# Altium project PCB_Attiny_composant.PrjPcb
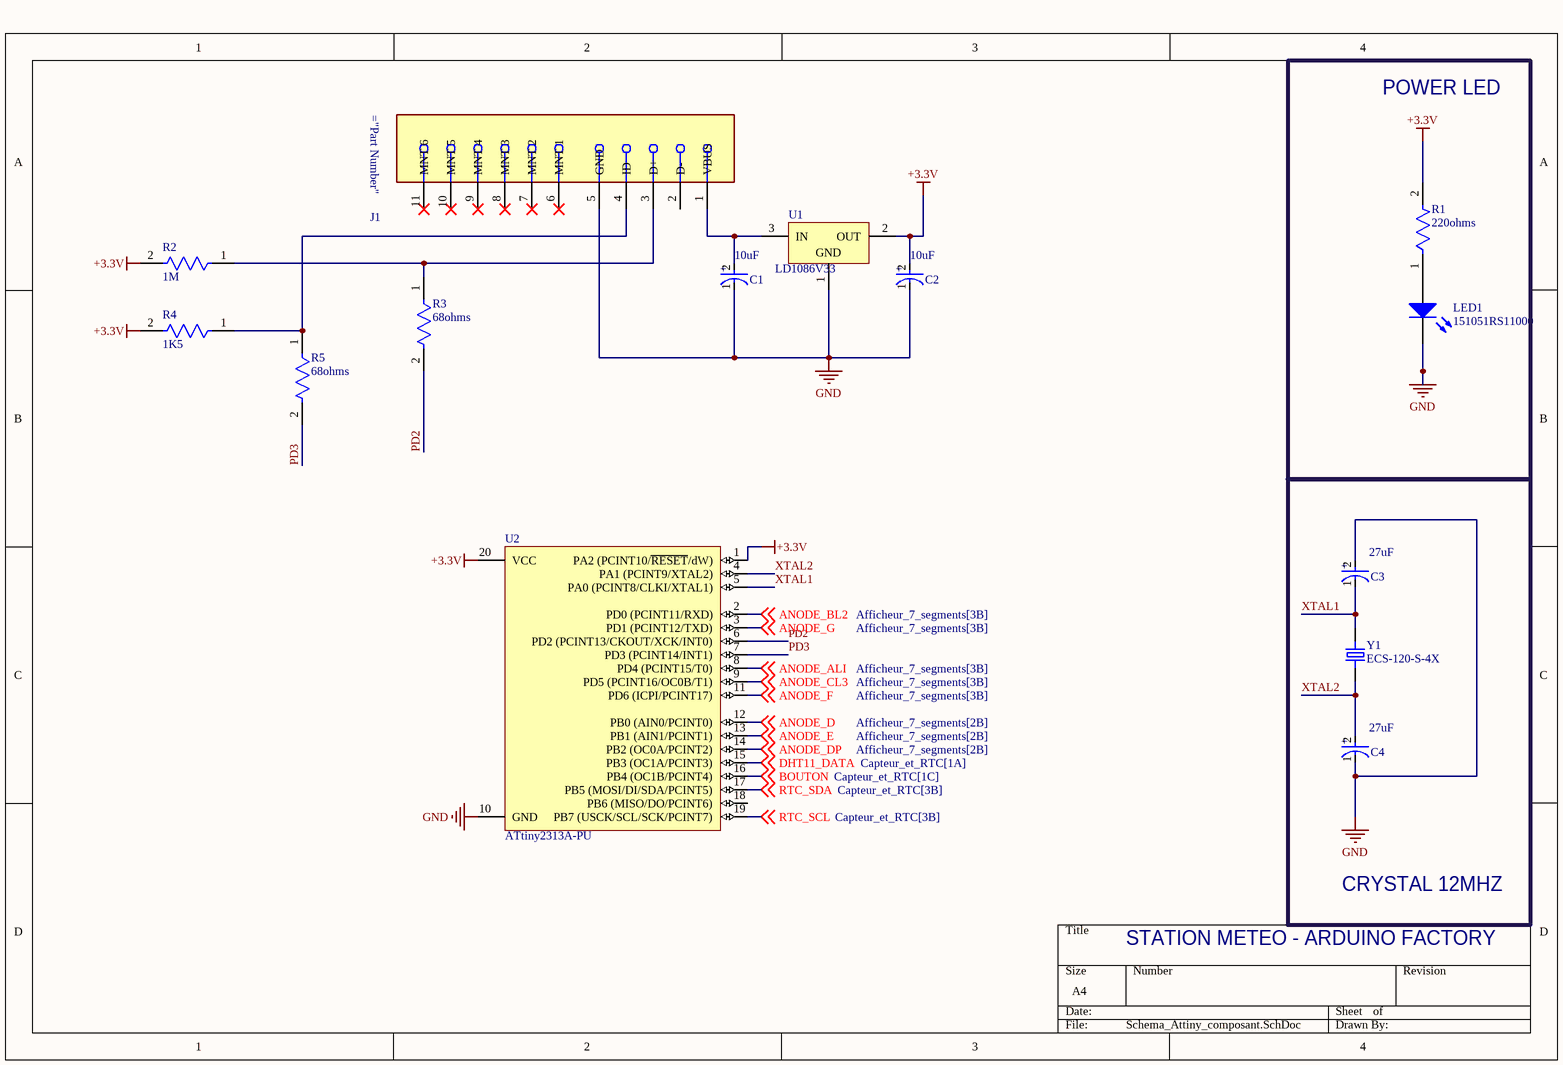
[diagram p0: Schema_Attiny_composant.SchDoc]
3 sheets, 20 parts. Net scope: global (net labels, ports and power ports of the same name join across sheets).
Board file: PCB_Attiny_composant.PcbDoc
Sheets:
  Schema_Attiny_composant.SchDoc
  Afficheur_7_segments.SchDoc
  Capteur_et_RTC.SchDoc

## Sheet Schema_Attiny_composant.SchDoc
size A4; SheetNumber: 1; SheetTotal: 3

### Parts
C1  10uF  [Rubycon_0_MFG]
C2  10uF  [Rubycon_0_MFG]
C3  27uF  [Rubycon_0_MFG]
C4  27uF  [Rubycon_0_MFG]
J1  105164-0001  [Molex_105164-0001_0]  (value not drawn)
LED1  151051RS11000  [Type 5mm]
R1  220ohms  [Stackpole_Electronics_Inc._CF14JT1K00_0]
R2  1M  [Stackpole_Electronics_Inc._CF14JT1K00_0]
R3  68ohms  [Stackpole_Electronics_Inc._CF14JT1K00_0]
R4  1K5  [Stackpole_Electronics_Inc._CF14JT1K00_0]
R5  68ohms  [Stackpole_Electronics_Inc._CF14JT1K00_0]
U1  LD1086V33  [TO220]
U2  ATtiny2313A-PU  [20P3]
Y1  ECS-120-S-4X  [XTAL_ECS-120-S-4X]

### Blocks framed on the sheet
POWER LED: LED1 R1
CRYSTAL 12MHZ: C3 C4 Y1

### Nets
+3.3V: C2.2(A) R1.2 R2.2 R4.2 U1.2(OUT) U2.1(PA2_(PCINT10/~{RESET}/dW)) U2.20(VCC)
GND: C1.1(C) C2.1(C) C3.2(A) C4.1(C) J1.5(GND) LED1.1(K) U1.1(GND) U2.10(GND)
ANODE_ALI: U2.8(PD4_(PCINT15/T0)) ; off-sheet ANODE_ALI
ANODE_BL2: U2.2(PD0_(PCINT11/RXD)) ; off-sheet ANODE_BL2
ANODE_CL3: U2.9(PD5_(PCINT16/OC0B/T1)) ; off-sheet ANODE_CL3
ANODE_D: U2.12(PB0_(AIN0/PCINT0)) ; off-sheet ANODE_D
ANODE_DP: U2.14(PB2_(OC0A/PCINT2)) ; off-sheet ANODE_DP
ANODE_E: U2.13(PB1_(AIN1/PCINT1)) ; off-sheet ANODE_E
ANODE_F: U2.11(PD6_(ICPI/PCINT17)) ; off-sheet ANODE_F
ANODE_G: U2.3(PD1_(PCINT12/TXD)) ; off-sheet ANODE_G
BOUTON: U2.16(PB4_(OC1B/PCINT4)) ; off-sheet BOUTON
DHT11_DATA: U2.15(PB3_(OC1A/PCINT3)) ; off-sheet DHT11_DATA
PD2: R3.2 U2.6(PD2_(PCINT13/CKOUT/XCK/INT0))
PD3: R5.2 U2.7(PD3_(PCINT14/INT1))
RTC_SCL: U2.19(PB7_(USCK/SCL/SCK/PCINT7)) ; off-sheet RTC_SCL
RTC_SDA: U2.17(PB5_(MOSI/DI/SDA/PCINT5)) ; off-sheet RTC_SDA
XTAL1: C3.1(C) U2.5(PA0_(PCINT8/CLKI/XTAL1)) Y1.2
XTAL2: C4.2(A) U2.4(PA1_(PCINT9/XTAL2)) Y1.1
NetC1_2: C1.2(A) J1.1(VBUS) U1.3(IN)
NetJ1_3: J1.3(D+) R2.1 R3.1
NetJ1_4: J1.4(ID) R4.1 R5.1
NetLED1_2: LED1.2(A) R1.1

Not connected (* = marked no-connect by the designer): J1 2(D-) 6(MNT_1)* 7(MNT_2)* 8(MNT_3)* 9(MNT_4)* 10(MNT_5)* 11(MNT_6)*; U2 18(PB6_(MISO/DO/PCINT6))

### Notes on the sheet
- STATION METEO - ARDUINO FACTORY
- (in symbol 35ZLH100MEFC6_3X11) +

### Library data of the parts
C1-C4 = 35ZLH100MEFC6_3X11
LED1 = 151051RS11000: THT LED round mono-color color lens, WL-TMRW, Red; Manufacturer: Wuerth Elektronik; ComponentLink1Description: Manufacturer URL; ComponentLink2Description: Datasheet; ComponentLink1URL: http://www.we-online.com; ComponentLink2URL: http://katalog.we-online.de/pbs/datasheet/7448042001.pdfhttp://katalog.we-online.de/pbs/datasheet/7448042001.pdfhttp://katalog.we-online.de/pbs/datasheet/7448042001.pdfhttp://katalog.we-online.de/pbs/datasheet/151051RS11000.pdf; Emitting color: Red; PartNumber: 151051RS11000; PackageReference: Type 5mm
R1-R5 = MF0207FTE52-10K
U1 = LD1086V33: 1.5A, Low Drop Positive Voltage Regulator, 3.3V, 3-Pin TO-220; ComponentLink1Description: Manufacturer URL; ComponentLink2Description: Datasheet; ComponentLink3Description: Package Specification; ComponentLink3URL: http://www.st.com/internet/com/TECHNICAL_RESOURCES/TECHNICAL_LITERATURE/PACKAGE_INFORMATION/CD00004649.pdf; DatasheetVersion: 11/07/2011; ComponentLink1URL: http://www.st.com; PackageVersion: ver3.0; PackageDescription: TO, Thru-Hole, Vertical, Heatsink Mounted; 3 In-Line Leads; Pitch 2.54 mm; ComponentLink2URL: http://www.st.com/internet/com/TECHNICAL_RESOURCES/TECHNICAL_LITERATURE/DATASHEET/CD00001884.pdf; PackageReference: TO220; PartNumber: LD1086V33
U2 = ATTINY2313A-PU: 8-bit AVR Microcontroller, 1.8-5.5V, 2KB Flash, 128 Bytes EEPROM, 128 Bytes SRAM, 20-pin PDIP, Industrial Grade (-40°C to 85°C), Pb-Free; Code_JEDEC: MS-001-AD; PackageVersion: revC, Jan-2004; DatasheetVersion: revA, Dec-2009; PackageDescription: 20-lead (0.300"/7.62mm Wide) Plastic Dual Inline Package (PDIP); PackageReference: 20P3; PartNumber: ATTINY2313A-PU
Y1 = ECS-120-S-4X: CRYSTAL T/H; Package: None; Price: None; Value: *; MP: ECS-120-S-4X; Availability: Unavailable

## Sheet Afficheur_7_segments.SchDoc
size A4; SheetNumber: 2; SheetTotal: 3
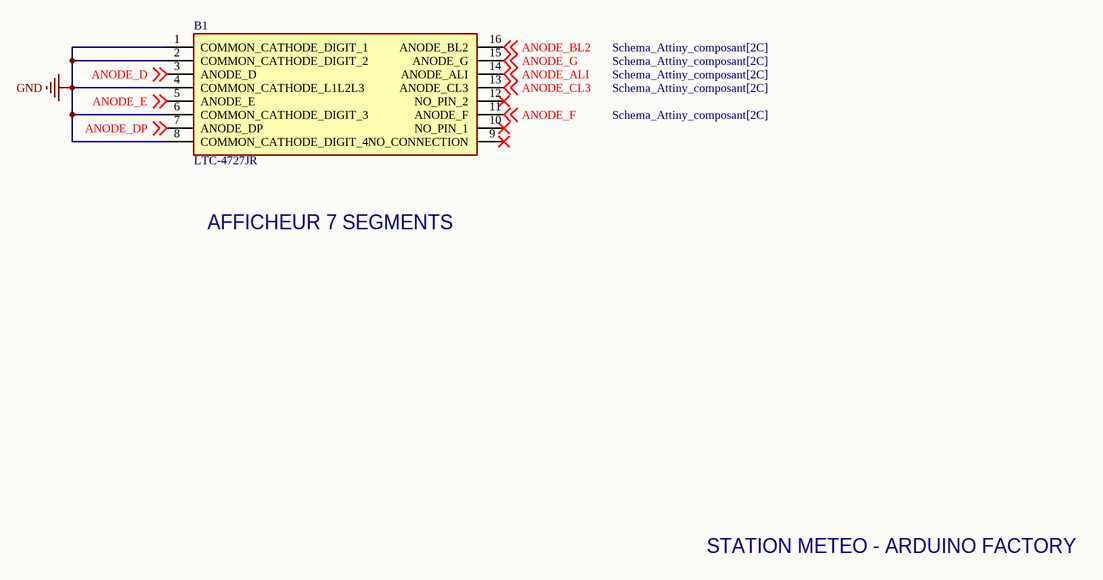
[diagram p1: Afficheur_7_segments.SchDoc]

### Parts
B1  LTC-4727JR  [DIP1016W75P254L4018H725Q16N]

### Nets
GND: B1.1(COMMON_CATHODE_DIGIT_1) B1.2(COMMON_CATHODE_DIGIT_2) B1.4(COMMON_CATHODE_L1L2L3) B1.6(COMMON_CATHODE_DIGIT_3) B1.8(COMMON_CATHODE_DIGIT_4)
ANODE_ALI: B1.14(ANODE_ALI) ; off-sheet ANODE_ALI
ANODE_BL2: B1.16(ANODE_BL2) ; off-sheet ANODE_BL2
ANODE_CL3: B1.13(ANODE_CL3) ; off-sheet ANODE_CL3
ANODE_D: B1.3(ANODE_D) ; off-sheet ANODE_D
ANODE_DP: B1.7(ANODE_DP) ; off-sheet ANODE_DP
ANODE_E: B1.5(ANODE_E) ; off-sheet ANODE_E
ANODE_F: B1.11(ANODE_F) ; off-sheet ANODE_F
ANODE_G: B1.15(ANODE_G) ; off-sheet ANODE_G

Not connected (* = marked no-connect by the designer): B1 9(NO_CONNECTION)* 10(NO_PIN_1)* 12(NO_PIN_2)*

### Notes on the sheet
- AFFICHEUR 7 SEGMENTS
- STATION METEO - ARDUINO FACTORY

### Library data of the parts
B1 = LTC-4727JR: Displays Panel 4DIGIT 35LED Sup. Red CC 14-Pin DIP Module; Manufacturer_Name: Lite-On; Geometry.Height: 7.25mm; Manufacturer_Part_Number: LTC-4727JR; Mouser Part Number: 859-LTC-4727JR; Mouser Price/Stock: https://www.mouser.co.uk/ProductDetail/Lite-On/LTC-4727JR?qs=WxFF5lh7QM1aHvF1YvDORQ%3D%3D; Arrow Part Number: LTC-4727JR; Arrow Price/Stock: https://www.arrow.com/en/products/ltc-4727jr/lite-on-technology?region=nac; Datasheet Link: https://componentsearchengine.com/Datasheets/1/LTC-4727JR.pdf

## Sheet Capteur_et_RTC.SchDoc
size A4; SheetNumber: 3; SheetTotal: 3
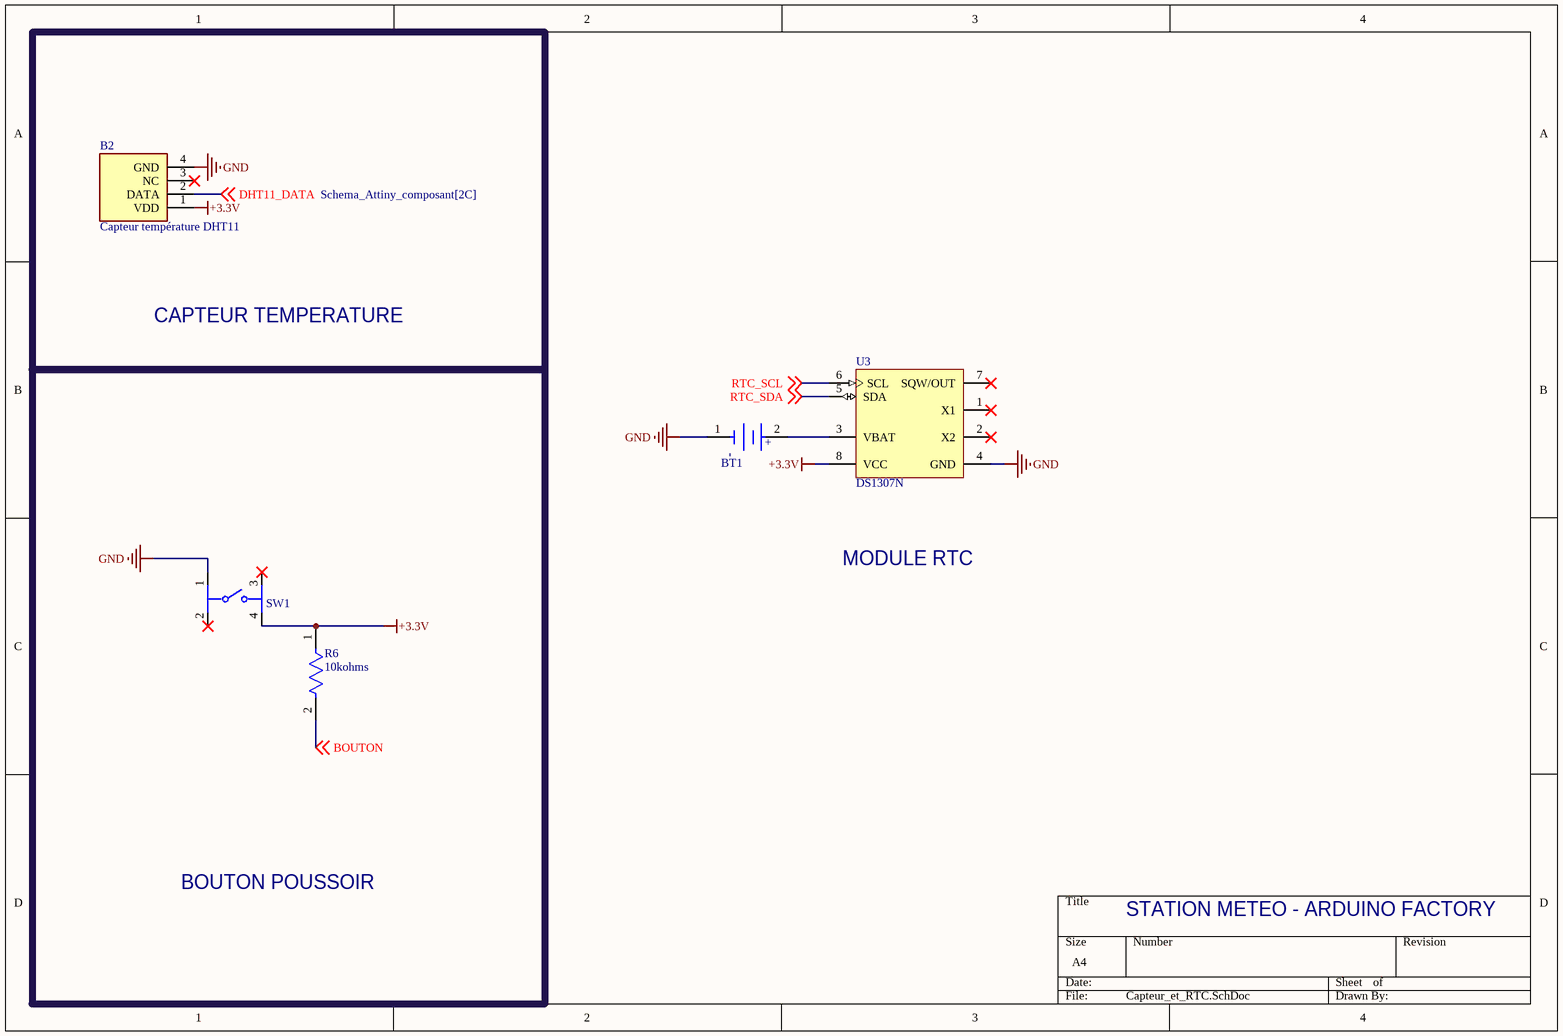
[diagram p2: Capteur_et_RTC.SchDoc]

### Parts
B2  Capteur température DHT11  [386]
BT1  3034TR  [Keystone_0_MFG]  (value not drawn)
R6  10kohms  [Stackpole_Electronics_Inc._CF14JT1K00_0]
SW1  1825910-2  [TE_0_0]  (value not drawn)
U3  DS1307N  [P8-2]

### Blocks framed on the sheet
CAPTEUR TEMPERATURE: B2
BOUTON POUSSOIR: R6 SW1

### Nets
+3.3V: B2.1(VDD) R6.1 SW1.4 U3.8(VCC)
GND: B2.4(GND) BT1.1(C) SW1.1 U3.4(GND)
BOUTON: R6.2 ; off-sheet BOUTON
DHT11_DATA: B2.2(DATA) ; off-sheet DHT11_DATA
RTC_SCL: U3.6(SCL) ; off-sheet RTC_SCL
RTC_SDA: U3.5(SDA) ; off-sheet RTC_SDA
NetBT1_2: BT1.2(A) U3.3(VBAT)

Not connected (* = marked no-connect by the designer): B2 3(NC)*; SW1 2* 3*; U3 1(X1)* 2(X2)* 7(SQW/OUT)*

### Notes on the sheet
- MODULE RTC
- STATION METEO - ARDUINO FACTORY
- (in symbol 3034TR) +; -

### Library data of the parts
B2 = 386: Adafruit Accessories DHT11 Basic Temp Humidity Sensor; Geometry.Height: 15.5mm; Manufacturer_Name: Adafruit; Manufacturer_Part_Number: 386; Mouser Part Number: 485-386; Mouser Price/Stock: https://www.mouser.co.uk/ProductDetail/Adafruit/386?qs=GURawfaeGuDbeGFpZ2393w%3D%3D; Arrow Part Number: 386; Arrow Price/Stock: https://www.arrow.com/en/products/386/adafruit-industries?region=nac; Datasheet Link: https://datasheet.datasheetarchive.com/originals/distributors/DKDS-1/1982.pdf
R6 = MF0207FTE52-10K
U3 = DS1307N: 64 x 8, Serial, I2C Real-Time Clock, 5.0V, 8-Pin PDIP, -40 to 85 degC; ComponentLink1Description: Manufacturer URL; ComponentLink2Description: Datasheet; DatasheetVersion: 10-Feb-2008; ComponentLink3URL: http://pdfserv.maxim-ic.com/package_dwgs/21-0043.PDF; ComponentLink3Description: Package Specification; ComponentLink1URL: http://www.maxim-ic.com; Code_JEDEC: MS-001-AB; PackageVersion: revE, 2011; PackageDescription: 8-Pin Plastic Dual-In-Line, Narrow (0.3in), Pitch 2.54 mm, PDIP(N); ComponentLink2URL: http://datasheets.maxim-ic.com/en/ds/DS1307.pdf; PackageReference: P8-2; PartNumber: DS1307N

## Nets that join several sheets
+3.3V: Schema_Attiny_composant (7 pins), Capteur_et_RTC (B2.1 R6.1 SW1.4 U3.8)
GND: Schema_Attiny_composant (8 pins), Afficheur_7_segments (5 pins), Capteur_et_RTC (B2.4 BT1.1 SW1.1 U3.4)
ANODE_ALI: Schema_Attiny_composant (U2.8), Afficheur_7_segments (B1.14)
ANODE_BL2: Schema_Attiny_composant (U2.2), Afficheur_7_segments (B1.16)
ANODE_CL3: Schema_Attiny_composant (U2.9), Afficheur_7_segments (B1.13)
ANODE_D: Schema_Attiny_composant (U2.12), Afficheur_7_segments (B1.3)
ANODE_DP: Schema_Attiny_composant (U2.14), Afficheur_7_segments (B1.7)
ANODE_E: Schema_Attiny_composant (U2.13), Afficheur_7_segments (B1.5)
ANODE_F: Schema_Attiny_composant (U2.11), Afficheur_7_segments (B1.11)
ANODE_G: Schema_Attiny_composant (U2.3), Afficheur_7_segments (B1.15)
BOUTON: Schema_Attiny_composant (U2.16), Capteur_et_RTC (R6.2)
DHT11_DATA: Schema_Attiny_composant (U2.15), Capteur_et_RTC (B2.2)
RTC_SCL: Schema_Attiny_composant (U2.19), Capteur_et_RTC (U3.6)
RTC_SDA: Schema_Attiny_composant (U2.17), Capteur_et_RTC (U3.5)